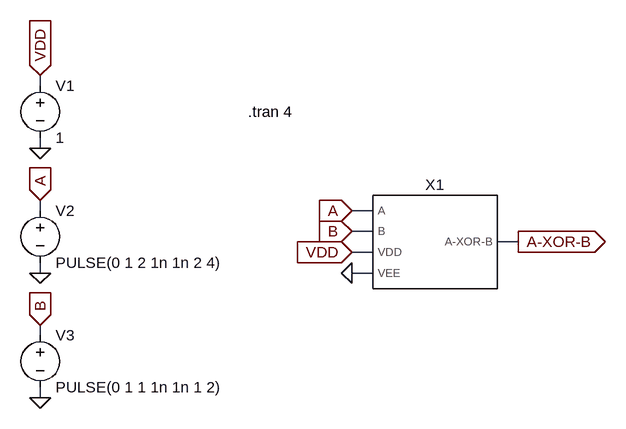
[diagram p0: schematic 2_Input_XOR_Gate_Symbol_Test.asc]
2_Input_XOR_Gate_Symbol_Test.asc, the LTspice schematic file:
Version 4
SHEET 1 920 680
WIRE 48 96 48 80
WIRE 48 192 48 176
WIRE 48 288 48 272
WIRE 560 288 528 288
WIRE 560 320 528 320
WIRE 784 336 752 336
WIRE 560 352 528 352
WIRE 48 384 48 368
WIRE 560 384 528 384
WIRE 48 480 48 464
WIRE 48 576 48 560
FLAG 48 576 0
FLAG 48 384 0
FLAG 48 192 0
FLAG 528 384 0
FLAG 48 80 VDD
IOPIN 48 80 In
FLAG 528 352 VDD
IOPIN 528 352 In
FLAG 48 272 A
IOPIN 48 272 In
FLAG 528 288 A
IOPIN 528 288 In
FLAG 48 464 B
IOPIN 48 464 In
FLAG 528 320 B
IOPIN 528 320 In
FLAG 784 336 A-XOR-B
IOPIN 784 336 Out
SYMBOL 2_Input_XOR_Gate_Symbol 656 336 R0
SYMATTR InstName X1
SYMBOL Voltage 48 80 R0
SYMATTR InstName V1
SYMATTR Value 1
SYMBOL Voltage 48 272 R0
SYMATTR InstName V2
SYMATTR Value PULSE(0 1 2 1n 1n 2 4)
SYMBOL Voltage 48 464 R0
SYMATTR InstName V3
SYMATTR Value PULSE(0 1 1 1n 1n 1 2)
TEXT 368 136 Left 2 !.tran 4

The netlist it stands for:
* 2_Input_XOR_Gate_Symbol_Test.asc
XX1 A B VDD 0 A-XOR-B 2_Input_XOR_Gate_Symbol  ; pins A B VDD VEE A-XOR-B
V1 VDD 0 1
V2 A 0 PULSE(0 1 2 1n 1n 2 4)
V3 B 0 PULSE(0 1 1 1n 1n 1 2)
.tran 4
.backanno
.end